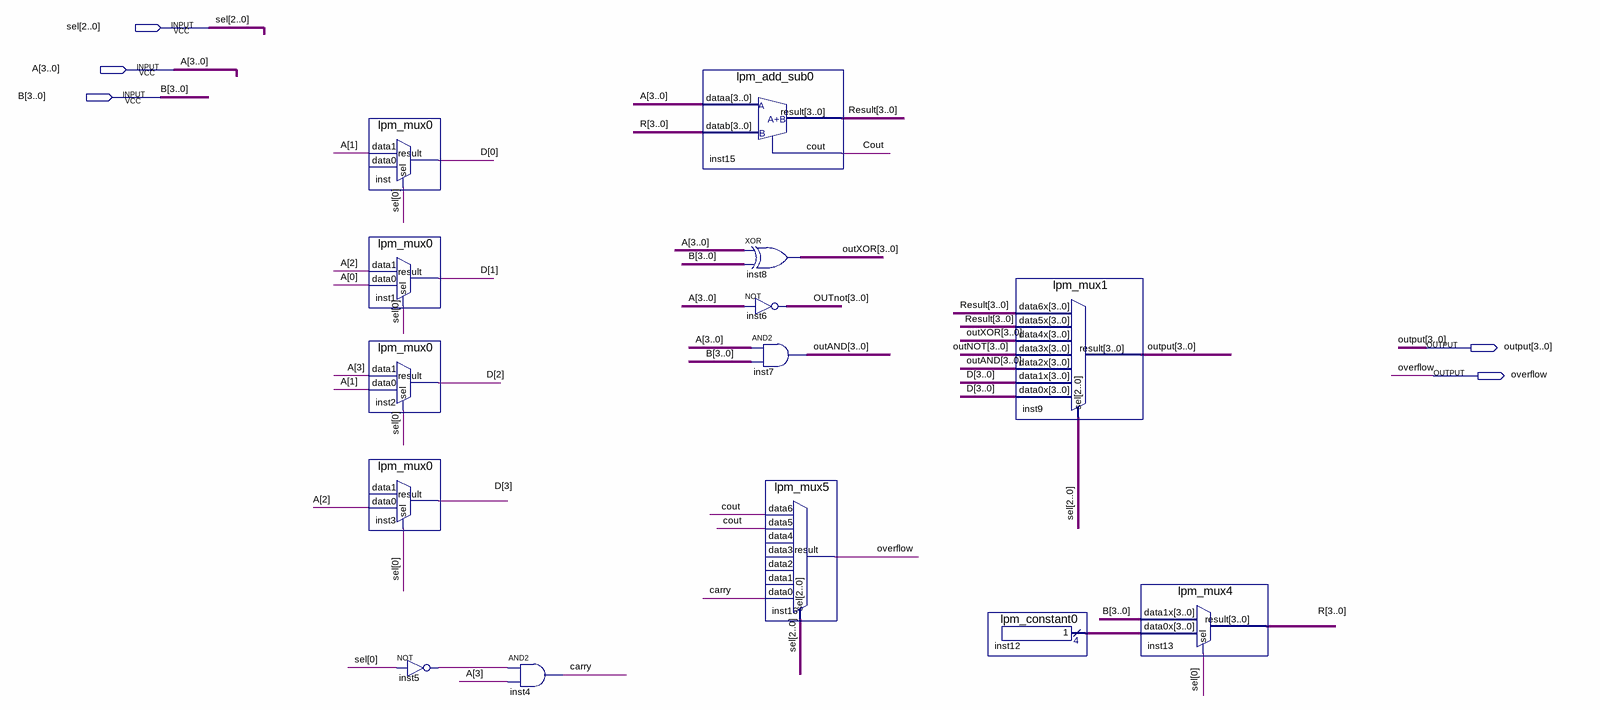
[diagram p0: schematic sheet]
// Quartus schematic alu.bdf as structural Verilog: 14 symbols, 5 pins
module alu (
  input  [2:0] sel,
  input  [3:0] A,
  input  [3:0] B,
  output [3:0] \output ,
  output overflow
);

  wire carry, Cout, inst5_out;
  wire [3:0] D, inst12_result, outAND, OUTnot, outXOR, R, Result;

  lpm_mux0 inst (.data1(A[1]), .sel(sel[0]), .result(D[0]));  // open: data0
  lpm_mux0 inst1 (.data1(A[2]), .data0(A[0]), .sel(sel[0]), .result(D[1]));
  lpm_mux0 inst2 (.data1(A[3]), .data0(A[1]), .sel(sel[0]), .result(D[2]));
  lpm_mux0 inst3 (.data0(A[2]), .sel(sel[0]), .result(D[3]));  // open: data1
  not inst5 (inst5_out, sel[0]);
  and inst4 (carry, inst5_out, A[3]);
  lpm_add_sub0 inst15 (.dataa(A), .datab(R), .result(Result), .cout(Cout));
  assign outXOR = A ^ B;  // XOR inst8, 4 bits wide
  assign OUTnot = ~A;  // NOT inst6, 4 bits wide
  assign outAND = A & B;  // AND2 inst7, 4 bits wide
  lpm_mux5 inst16 (
    .data6(Cout), .data5(Cout), .data0(carry), .sel(sel), .result(overflow));  // open: data4, data3, data2, data1
  lpm_constant0 inst12 (.result(inst12_result));
  lpm_mux1 inst9 (
    .data6x(Result), .data5x(Result), .data4x(outXOR), .data3x(OUTnot), .data2x(outAND), .data1x(D),
    .data0x(D), .sel(sel), .result(\output ));
  lpm_mux4 inst13 (.data1x(B), .data0x(inst12_result), .sel(sel[0]), .result(R));
endmodule
